# Altium schematic sheet Power.SchDoc
size A4
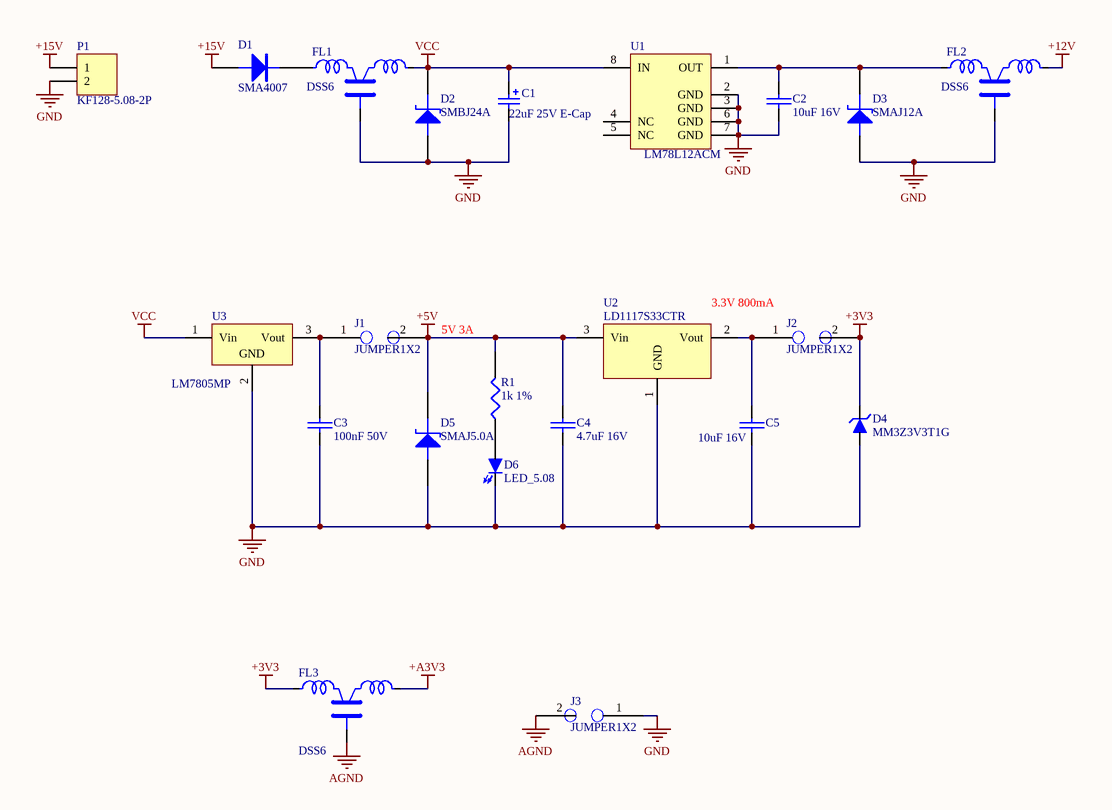
[diagram p0: Power.SchDoc]

## Parts
C1  22uF 25V E-Cap  [SMT E-Cap 5x5.4]
C2  10uF 16V  [CAPC3216N]
C3  100nF 50V  [CAPC2012N]
C4  4.7uF 16V  [CAPC2012N]
C5  10uF 16V  [CAPC3216N]
D1  SMA4007  [DSO-C2/G1.6]
D2  SMBJ24A  [DSO-C2/X2.3]
D3  SMAJ12A  [DSO-C2/G1.6]
D4  MM3Z3V3T1G  [SOD-323]
D5  SMAJ5.0A  [DSO-C2/G1.6]
D6  LED_5.08  [LED5.08/2.54-2]
FL1  DSS6  [DSS6]
FL2  DSS6  [DSS6]
FL3  DSS6  [DSS6]
J1  JUMPER1X2  [JP-SOLDER-H1X2-3X2]  (no BOM)
J2  JUMPER1X2  [JP-SOLDER-H1X2-3X2]  (no BOM)
J3  JUMPER1X2  [JP-SOLDER-H1X2-3X2]  (no BOM)
P1  KF128-5.08-2P  [KF128-5.08-2P]
R1  1k 1%  [RESC2012N]
U1  LM78L12ACM  [SO8_M]
U2  LD1117S33CTR  [SOT223-4M]
U3  LM7805MP  [SOT223-4M]

## Nets
+3V3: D4.1(K) FL3.1 J2.2
+5V: C4.1 D5.2(K) J1.2 R1.2 U2.3(Vin)
+12V: FL2.3
+15V: D1.1(A) P1.1
+A3V3: FL3.3
AGND: FL3.2 J3.2
GND: C1.2 C2.2 C3.1 C4.2 C5.2 D2.1(A) D3.1(A) D4.2(A) D5.1(A) D6.2(K) FL1.2 FL2.2 J3.1 P1.2 U1.2(GND) U1.3(GND) U1.6(GND) U1.7(GND) U2.1(GND) U3.2(GND)
VCC: C1.1 D2.2(K) FL1.3 U1.8(IN) U3.1(Vin)
NetC2_1: C2.1 D3.2(K) FL2.1 U1.1(OUT)
NetC3_2: C3.2 J1.1 U3.3(Vout)
NetC5_1: C5.1 J2.1 U2.2(Vout)
NetD1_2: D1.2(K) FL1.1
NetD6_1: D6.1(A) R1.1

Not connected (* = marked no-connect by the designer): U1 4(NC) 5(NC)

## Notes on the sheet
- 5V 3A
- 3.3V 800mA

## Library data of the parts
C1 = Cap Pol1: Polarized Capacitor (Radial); Published: 8-Jun-2000; LatestRevisionDate: 17-Jul-2002; LatestRevisionNote: Re-released for DXP Platform.; PackageReference: RB7.6-15; Publisher: Altium Limited
C2-C5 = CAP: Price: 0.025
D1 = DIODE: Price: 0.4
D2 = ZENER2: Zener Diode
D3 = ZENER2: Zener Diode; Manufacturer: Littlefuse; Price: 0.65
D4 = Zener Diode: Manufacturer: ON; Price: *
D5 = ZENER2: Zener Diode; Manufacturer: Vishay; Price: 0.65
D6 = LED_5.08: Through hole LED dia.5.08
FL1-FL3 = DSS6: Murata EMI suppression filter; Manufacturer: Murata; Price: 0.5
P1 = Header 2: Power supply connector; LatestRevisionDate: 17-Jul-2002; LatestRevisionNote: Re-released for DXP Platform.; Publisher: Altium Limited
R1 = RES1
U1 = LM78L05ACM: 3-Terminal Positive Regulators; Manufacturer: National Semiconductor; CompType: LDO IC; PackageTopMarking: NSZXTT*LM78L*05ACM; Published: 4-Dec-2008; DatasheetVersion: Apr-2006; PackageVersion: revL, Sep-2006; PackageReference: M08A; Publisher: Altium Limited; PackageDescription: SOIC Narrow, 4.9 x 3.9 x 1.45mm, 8 Lead, 1.27mm Pitch; PartNumber: LM78L05ACM; RoHS: O; PinCount: 8; DigiKeyPartNumber: LM78L05ACM-ND; Code_JEDEC: MS-012-AA; ComponentLink1Description: LM78L05 Datasheet; ComponentLink1URL: http://www.national.com/ds/LM/LM78L05.pdf; ComponentLink2Description: LM78L05 Web Page; ComponentLink2URL: http://www.national.com/pf/LM/LM78L05.html; ComponentLink3Description: M08A Package Page; ComponentLink3URL: http://www.national.com/packaging/folders/m08a.html; Code_IPC: SOIC127P600-8
U2 = VOLTREG: ST Low drop voltage regulator; Price: 1.5; Manufacturer: ST
U3 = Volt Reg: Voltage Regulator; Published: 24-Mar-1999; LatestRevisionDate: 29-May-2009; LatestRevisionNote: IPC-7351 Footprint Added.; PackageReference: D2PAK; Publisher: Altium Limited; PackageDescription: 3-Pin Transistor Outline Package 2.54 mm Pitch, 15.1 mm Lead Span